# EAGLE design GeisaBoard (EAGLE 9.1.0)
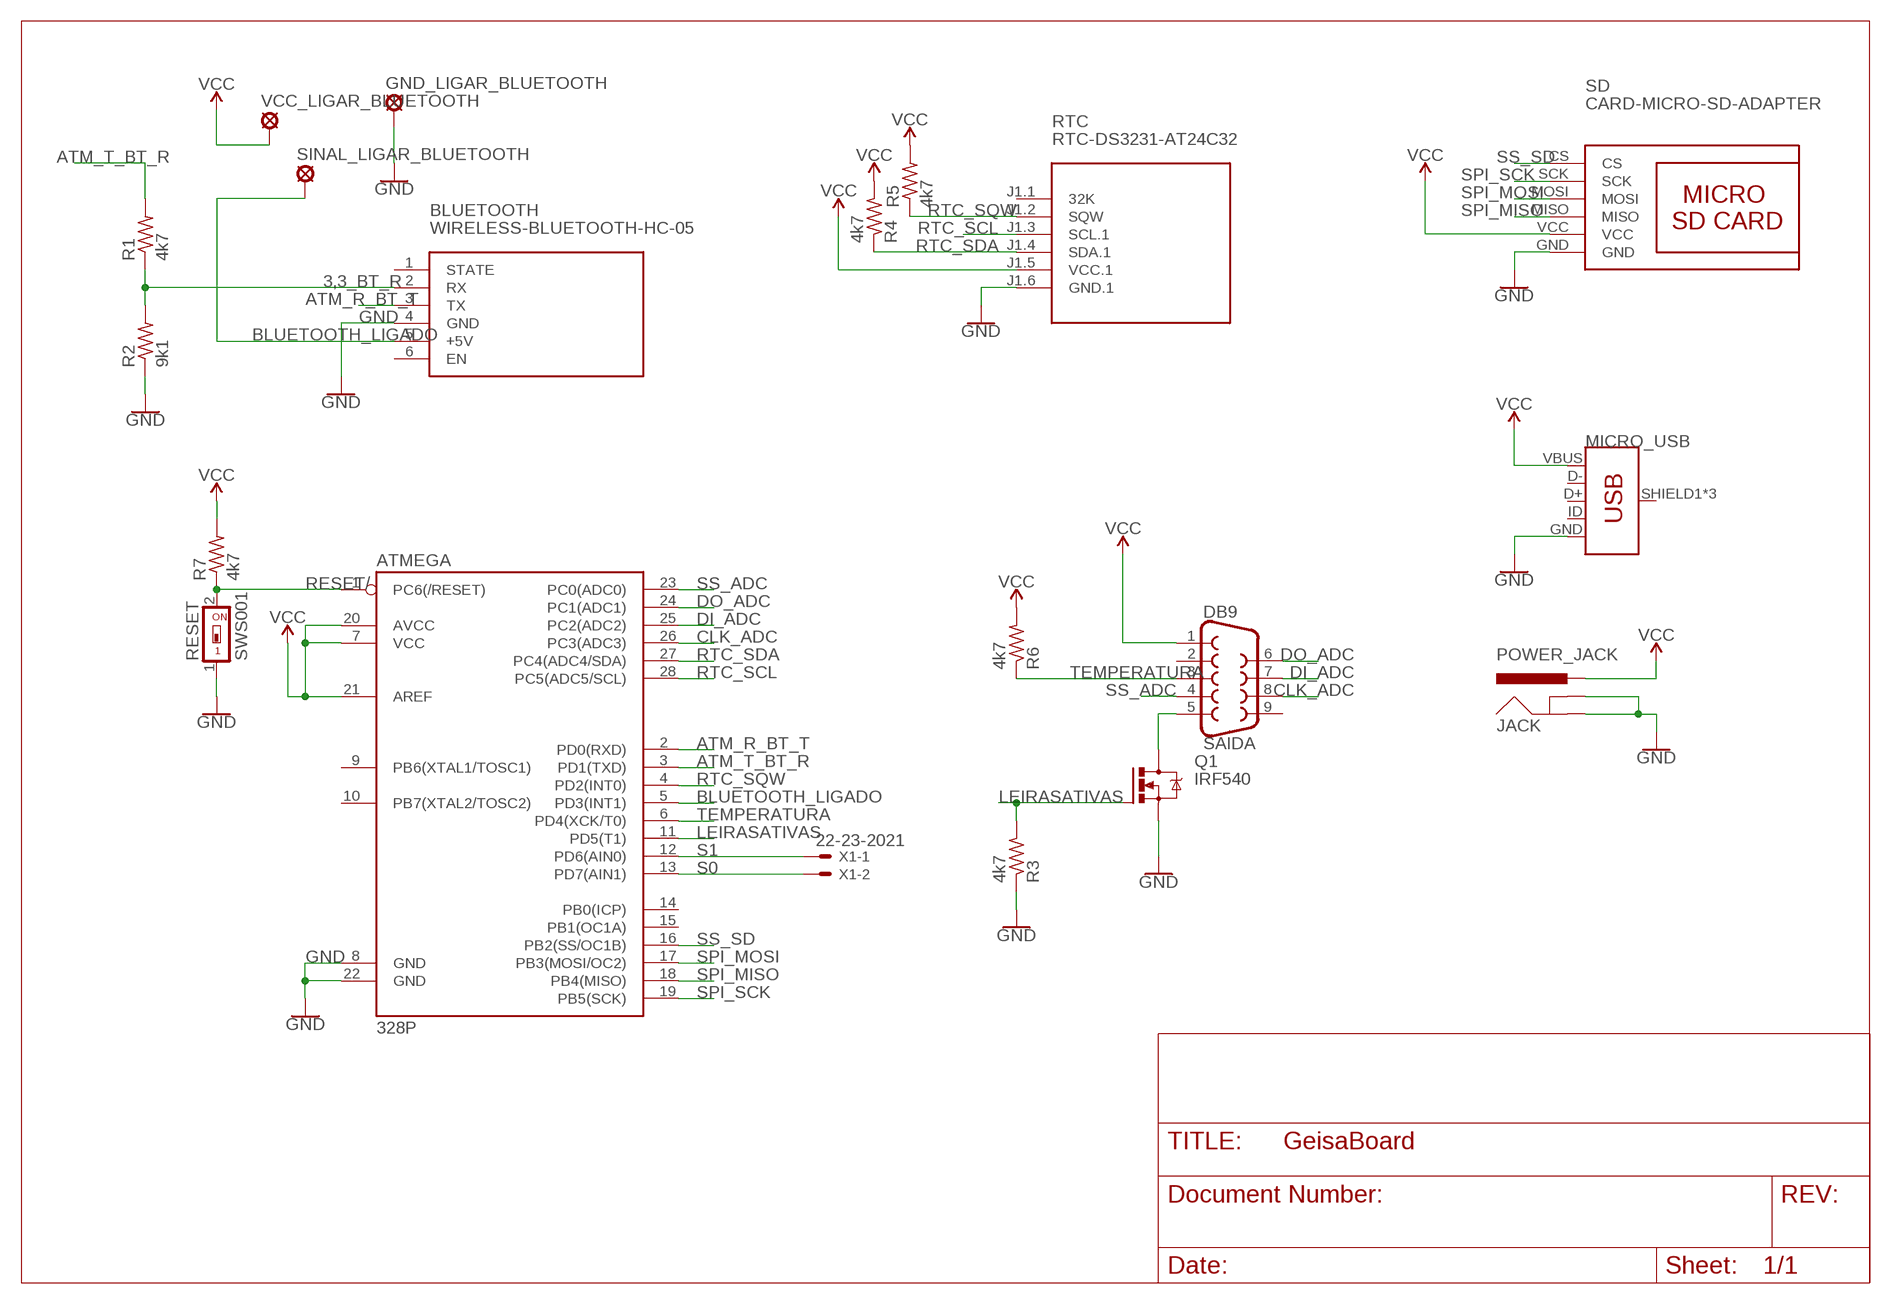
[diagram p0: schematic, sheet 1]

## Parts
ATMEGA  328P  ATMEGA328P_PDIP  [DIP28]
BLUETOOTH  WIRELESS-BLUETOOTH-HC-05  [WIRELESS-BLUETOOTH-HC-05]
DB9  SAIDA  DB9FEMALE  [DB9]
GND_LIGAR_BLUETOOTH  LSP11  [LSP11]
JACK  POWER_JACK  [POWER_JACK_PTH]
MICRO_USB  USB_MICRO-BREDUCED_PASTE  [USB-B-MICRO-SMD_RED_PASTE]
Q1  IRF540  [TO220BV]
R1  4k7  R-US_0204/7  [0204/7]
R2  9k1  R-US_0204/7  [0204/7]
R3  4k7  R-US_0204/7  [0204/7]
R4  4k7  R-US_0204/7  [0204/7]
R5  4k7  R-US_0204/7  [0204/7]
R6  4k7  R-US_0204/7  [0204/7]
R7  4k7  R-US_0204/7  [0204/7]
RESET  SWS001  [SMS-001]
RTC  RTC-DS3231-AT24C32  [RTC-DS3231-AT24C32]
SD  CARD-MICRO-SD-ADAPTER  [CARD-MICRO-SD-ADAPTER]
SINAL_LIGAR_BLUETOOTH  LSP11  [LSP11]
VCC_LIGAR_BLUETOOTH  LSP11  [LSP11]
X1  22-23-2021  [22-23-2021]

## Nets
3,3_BT_R: BLUETOOTH.2(RX) R1.1 R2.2
ATM_R_BT_T: ATMEGA.2(PD0(RXD)) BLUETOOTH.3(TX)
ATM_T_BT_R: ATMEGA.3(PD1(TXD)) R1.2
BLUETOOTH_LIGADO: ATMEGA.5(PD3(INT1)) BLUETOOTH.5(+5V) SINAL_LIGAR_BLUETOOTH.MP
CLK_ADC: ATMEGA.26(PC3(ADC3)) DB9.8
DI_ADC: ATMEGA.25(PC2(ADC2)) DB9.7
DO_ADC: ATMEGA.24(PC1(ADC1)) DB9.6
GND [alimentação]: ATMEGA.8(GND) ATMEGA.22(GND) BLUETOOTH.4(GND) GND_LIGAR_BLUETOOTH.MP JACK.GND JACK.GNDBREAK MICRO_USB.GND Q1.S R2.1 R3.1 RESET.1 RTC.J1.6(GND.1) SD.GND
LEIRASATIVAS: ATMEGA.11(PD5(T1)) Q1.G R3.2
N$2 [alimentação]: DB9.5 Q1.D
RESET/: ATMEGA.1(PC6(/RESET)) R7.1 RESET.2
RTC_SCL: ATMEGA.28(PC5(ADC5/SCL)) RTC.J1.3(SCL.1)
RTC_SDA: ATMEGA.27(PC4(ADC4/SDA)) R4.1 RTC.J1.4(SDA.1)
RTC_SQW: ATMEGA.4(PD2(INT0)) R5.1 RTC.J1.2(SQW)
S0: ATMEGA.13(PD7(AIN1)) X1.2
S1: ATMEGA.12(PD6(AIN0)) X1.1
SPI_MISO: ATMEGA.18(PB4(MISO)) SD.MISO
SPI_MOSI: ATMEGA.17(PB3(MOSI/OC2)) SD.MOSI
SPI_SCK: ATMEGA.19(PB5(SCK)) SD.SCK
SS_ADC: ATMEGA.23(PC0(ADC0)) DB9.4
SS_SD: ATMEGA.16(PB2(SS/OC1B)) SD.CS
TEMPERATURA: ATMEGA.6(PD4(XCK/T0)) DB9.3 R6.1
VCC [alimentação]: ATMEGA.7(VCC) ATMEGA.20(AVCC) ATMEGA.21(AREF) DB9.1 JACK.PWR MICRO_USB.VBUS R4.2 R5.2 R6.2 R7.2 RTC.J1.5(VCC.1) SD.VCC VCC_LIGAR_BLUETOOTH.MP
Unconnected: ATMEGA.9(PB6(XTAL1/TOSC1)) ATMEGA.10(PB7(XTAL2/TOSC2)) ATMEGA.14(PB0(ICP)) ATMEGA.15(PB1(OC1A)) BLUETOOTH.1(STATE) BLUETOOTH.6(EN) DB9.2 DB9.9 MICRO_USB.D+ MICRO_USB.D- MICRO_USB.ID MICRO_USB.SHIELD1(SHIELD) MICRO_USB.SHIELD2(SHIELD) MICRO_USB.SHIELD3(SHIELD) RTC.J1.1(32K)

## Library data of the parts
ATMEGA = SparkFun-IC-Microcontroller:ATMEGA328P_PDIP: Atmel 328P Through hole ATMEGA328P uC used in the Arduino 32kb flash, 1k EEPROM, 2k SRAM Datasheet <http://www.sparkfun.com/datasheets/Components/SMD/ATMega328.pdf> SparkFun Products Storefront component: AVR 28 Pin 20MHz 32K 6A/D - ATMega328P <https://www.sparkfun.com/products/9061> (COM-09061) SparkFun Simon Says - Through-Hole Soldering Kit <https://www.sparkfun.com/products/10547> (KIT-10547) SparkFun Learn to Solder - Simon Says <https://www.sparkfun.com/products/13708> (KIT-13708) SparkFun BigTime Watch Kit <https://www.sparkfun.com/products/11734> (KIT-11734) SparkFun ClockIt <https://www.sparkfun.com/products/10930> (KIT-10930) SparkFun Serial Enabled LCD Kit <https://www.sparkfun.com/products/10097> (LCD-10097) SparkFun Simon Tilts - Through Hole Soldering Kit <https://www.sparkfun.com/products/12634> (KIT-12634) SparkFun Frequency Counter Kit <https://www.sparkfun.com/products/10140> (KIT-10140) FabFM Radio Kit <https://www.sparkfun.com/products/11043> (KIT-11043) SparkFun Binary Blaster Kit <https://www.sparkfun.com/products/12037> (KIT-12037) SparkFun Metro-Gnome <https://www.sparkfun.com/products/9236> (KIT-09236) ATmega328 with Arduino Optiboot (Uno) <https://www.sparkfun.com/products/10524> (DEV-10524); PROD_ID: IC-09136
BLUETOOTH = diy-modules:WIRELESS-BLUETOOTH-HC-05: Bluetooth Transceiver Module based on HC-05 board Tutorial is available here: https://arduino-info.wikispaces.com/BlueTooth-HC05-HC06-Modules-How-To Click here to find device on ebay.com <http://www.ebay.com/sch/hc-05+module+rs232>
DB9 = SparkFun-Connectors:DB9: DB9 Connector Standard DB9 (D-Sub 9) serial connector. Can be used for CAN bus as well as RS485 and RS232. Footprint production proven. Here is the female version connector we sell at SparkFun: 9 Pin Female Serial Connector - PCB Mount <https://www.sparkfun.com/products/429> (PRT-00429) This connector has been used on the following SparkFun products: SparkFun RS232 Shifter - SMD <https://www.sparkfun.com/products/449> (PRT-00449) SparkFun RS232 Shifter SMD (No DB9) <https://www.sparkfun.com/products/8780> (PRT-08780); PROD_ID: CONN-08194
GND_LIGAR_BLUETOOTH SINAL_LIGAR_BLUETOOTH VCC_LIGAR_BLUETOOTH = solpad:LSP11: SOLDER PAD drill 1.1 mm
JACK = SparkFun-Connectors:POWER_JACK: Power Jack Connector This is the standard 5.5mm barrel jack for power. The PTH is the most common, proven, reliable, footprint. The Slot footprint only works if the mill layer is transmitted to the PCB fab house so be warned. Here are the connectors we sell at SparkFun: DC Barrel Power Jack/Connector <https://www.sparkfun.com/products/119> (PRT-00119) DC Barrel Power Jack/Connector (SMD) <https://www.sparkfun.com/products/12748> (PRT-12748) DC Barrel Jack Adapter - Breadboard Compatible <https://www.sparkfun.com/products/10811> (PRT-10811) It is used on this SparkFun product (and many, many others): SparkFun RedBoard - Programmed with Arduino <https://www.sparkfun.com/products/12757> (DEV-12757) Also, if you need a mating power supply or connector, please check these out: Wall Adapter Power Supply - 9VDC 650mA <https://www.sparkfun.com/products/298> (TOL-00298) DC Barrel Jack Adapter - Male <https://www.sparkfun.com/products/10287> (PRT-10287); PROD_ID: CONN-08197
MICRO_USB = SparkFun-Connectors:USB_MICRO-B: USB Type Micro-B Connector Male/female and PTH/SMT variants SparkFun Products: SparkFun microB USB Breakout <https://www.sparkfun.com/products/12035> SparkFun USB microB Plug Breakout <https://www.sparkfun.com/products/10031> SparkFun ESP8266 Thing <https://www.sparkfun.com/products/13231>; PROD_ID: CONN-11752
Q1 = transistor-power:IRF540: HEXFET Power MOSFET
R1-R7 = rcl:R-US_: RESISTOR, American symbol
RESET = smd-special:SWS001: SMD Dip Switch 1 pol.
RTC = Geisa:RTC-DS3231-AT24C32: RTC Module with Battery and EEPROM based on DS3231 and AT24C32 chips Tutorial can be found here: https://edwardmallon.wordpress.com/2014/05/21/using-a-cheap-3-ds3231-rtc-at24c32-eeprom-from-ebay/ Click here to find device on ebay.com <http://www.ebay.com/sch/DS3231+AT24C32+module>
SD = Geisa:CARD-MICRO-SD-ADAPTER
X1 = con-molex:22-23-2021: .100" (2.54mm) Center Header - 2 Pin; MF: MOLEX; MPN: 22-23-2021; OC_FARNELL: 1462926; OC_NEWARK: 25C3832

## Net classes
0 default: width 0.508 mm
1 alimentação: width 1.016 mm

## Board
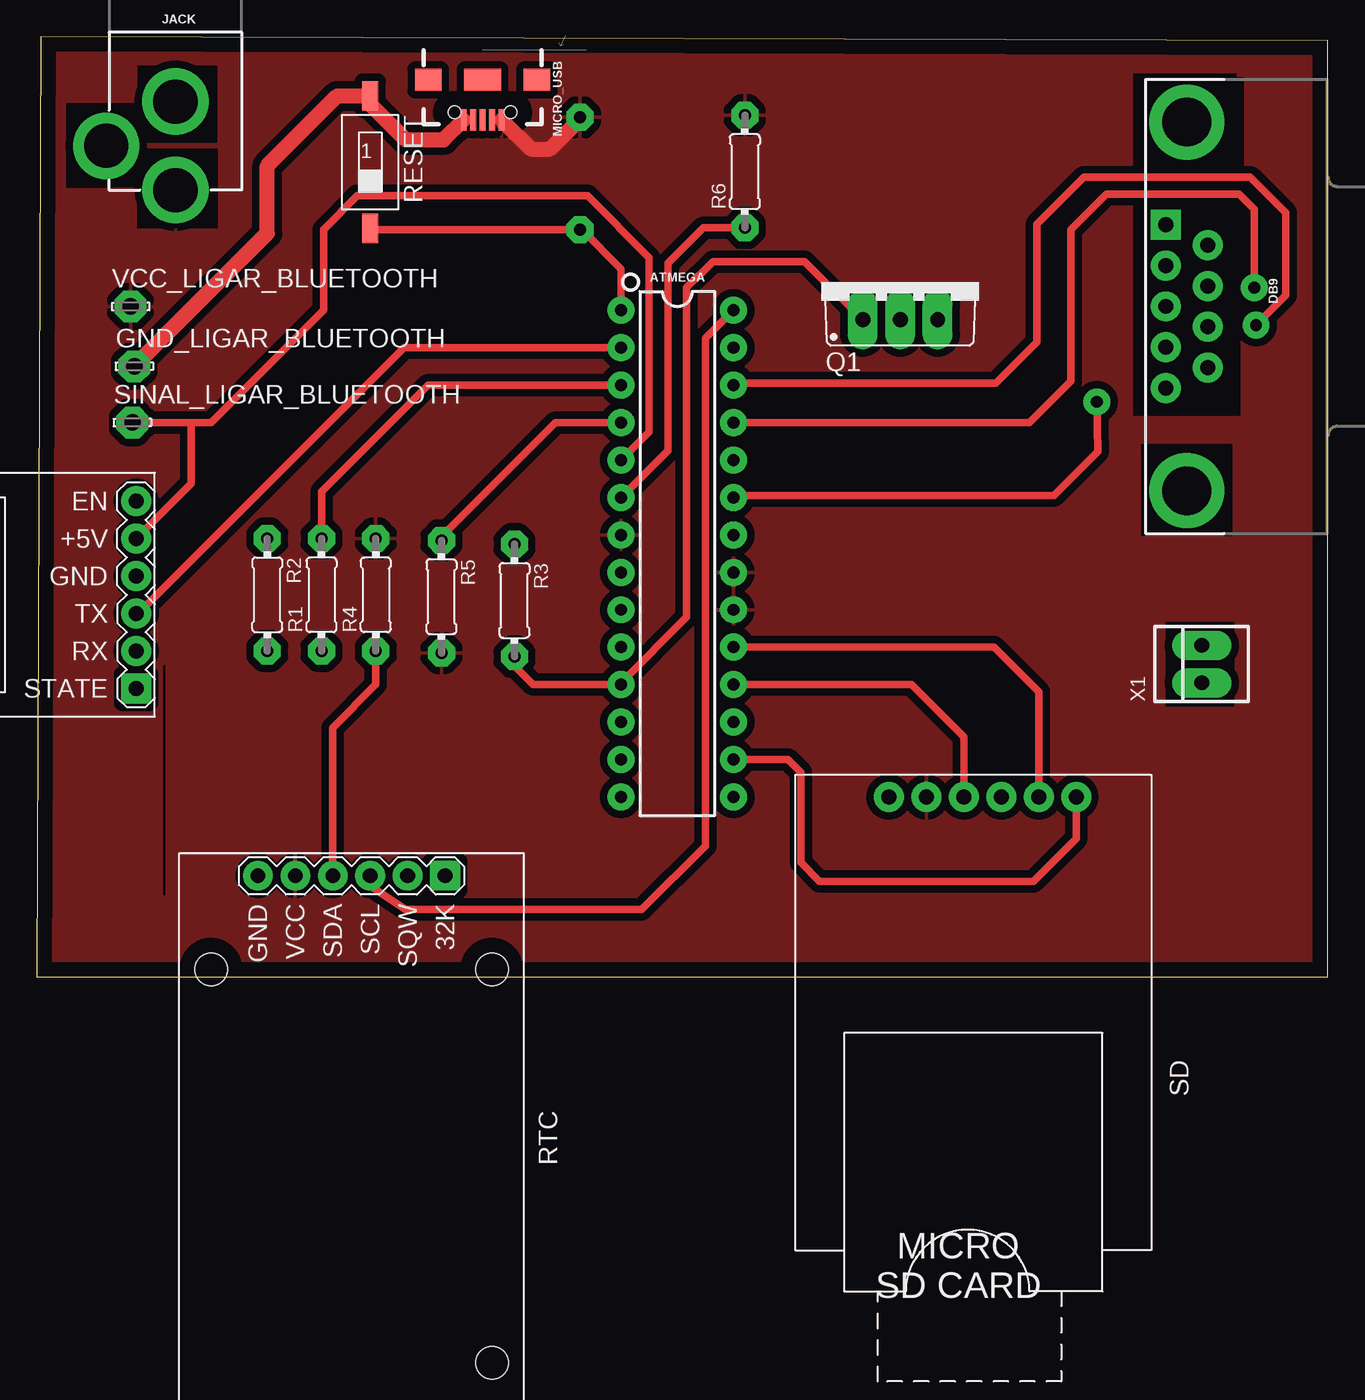
[diagram p1: board, top side]
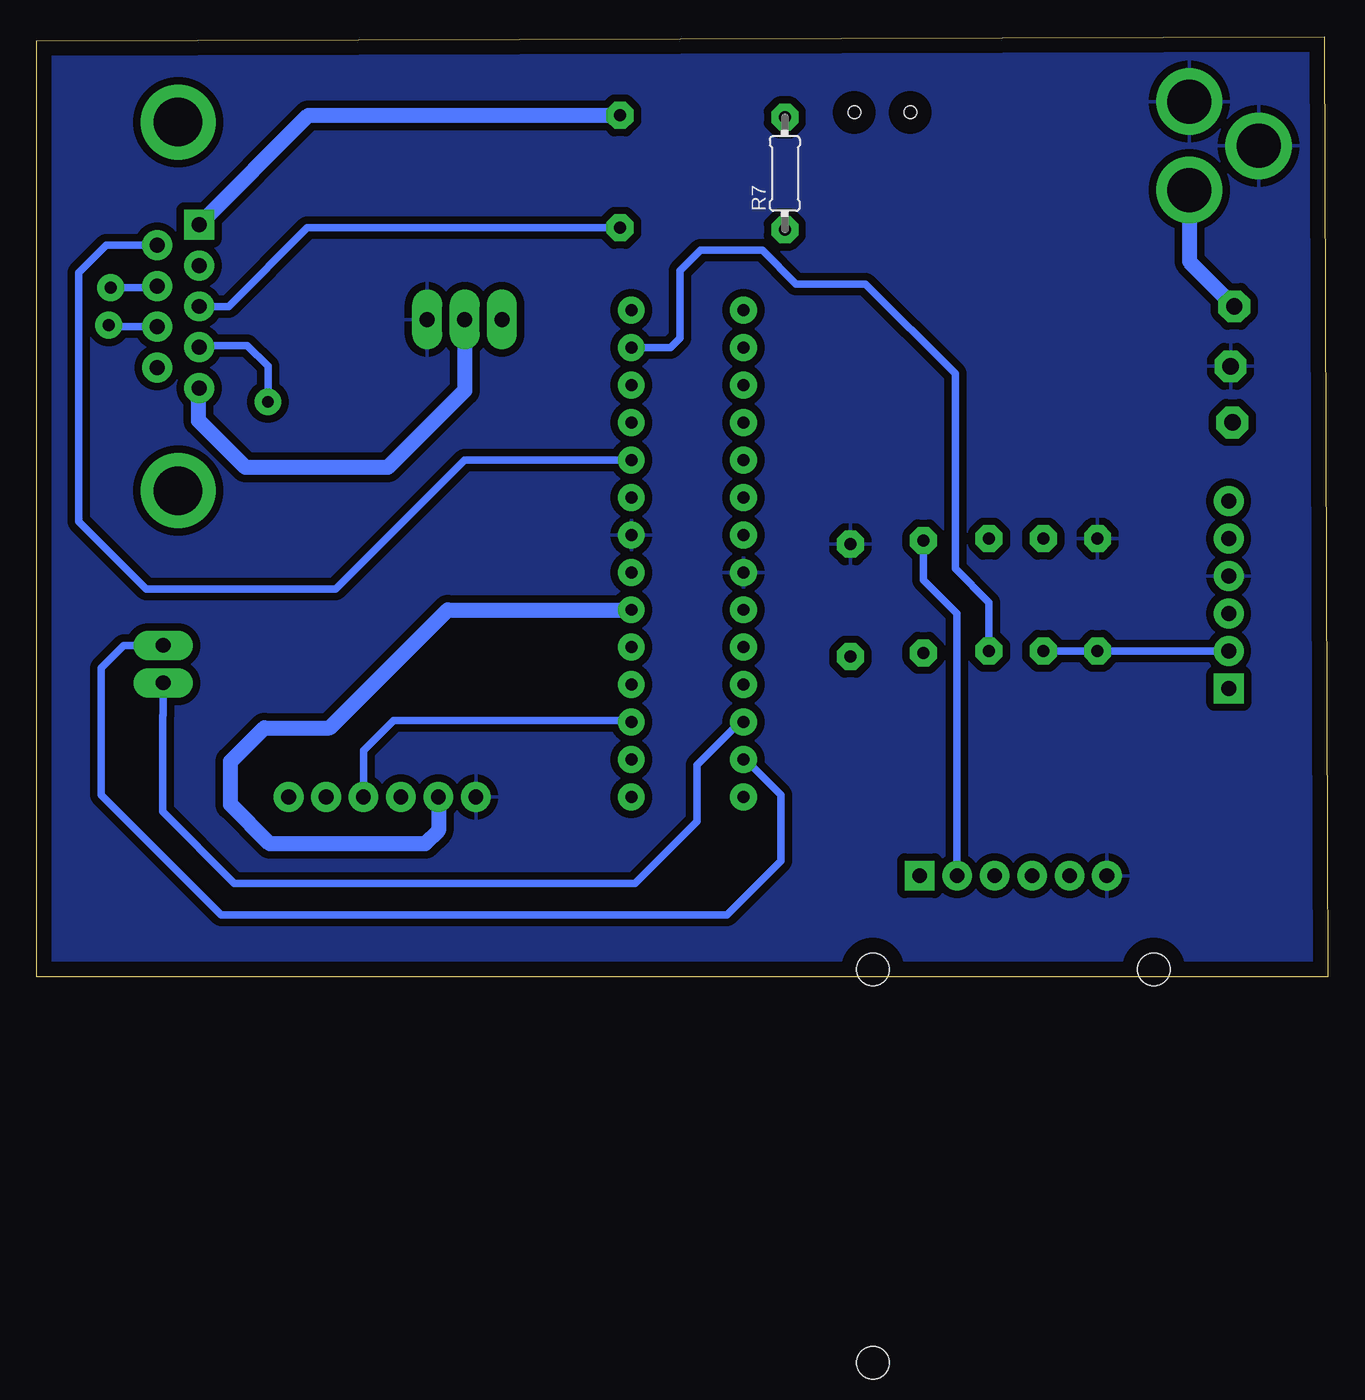
[diagram p2: board, bottom side, seen from below]

Size 87.55 x 63.74 mm. Coordinates in mm from the lower left corner, seen from the top.
Outline: 0,0 87.55,0 87.55,63.49 0.25,63.74 0,0
Copper layers (1*16): Top 0.035mm / dielectric 1.5mm / Bottom 0.035mm
Design rules "default *": minimum track width 20mil, minimum drill 0.8mm, track to track 20mil, track to pad 20mil, pad to pad 20mil, via to via 20mil, smd to smd 20mil, copper to edge 40mil, drill to drill 31.5mil, minimum pad ring 20mil, minimum via ring 20mil, stop-mask expansion 4mil, vias tented up to drill 0mil, thermal gap 20mil
tRestrict: area 8.6,27.9 to 11.2,27.9; area 74.4,38.1 to 81.5,52.6; area 74.2,54.9 to 81.8,61.2; area 74.9,30 to 81,36.1; area 76.6,18.4 to 81.2,24; area 68.6,-4.1 to 84.3,-1; area 8.6,5.6 to 8.6,21.1; area 2,53.6 to 7.1,59.2; area 6.9,50.8 to 12.2,56.1; area 6.9,56.6 to 12.2,61.7

### Footprints (pad centres in the part's own frame; a part is rotated, then mirrored left to right if it is on the bottom)
DIP28 = drill 0.813 pad 1.626: 1 -16.51,-3.81; 2 -13.97,-3.81; 3 -11.43,-3.81; 4 -8.89,-3.81; 5 -6.35,-3.81; 6 -3.81,-3.81; 7 -1.27,-3.81; 8 1.27,-3.81; 9 3.81,-3.81; 10 6.35,-3.81; 11 8.89,-3.81; 12 11.43,-3.81; 13 13.97,-3.81; 14 16.51,-3.81; 15 16.51,3.81; 16 13.97,3.81; 17 11.43,3.81; 18 8.89,3.81; 19 6.35,3.81; 20 3.81,3.81; 21 1.27,3.81; 22 -1.27,3.81; 23 -3.81,3.81; 24 -6.35,3.81; 25 -8.89,3.81; 26 -11.43,3.81; 27 -13.97,3.81; 28 -16.51,3.81
WIRELESS-BLUETOOTH-HC-05 = drill 1 square: 1 -6.35,-17.145 | drill 1: 2 -3.81,-17.145; 3 -1.27,-17.145; 4 1.27,-17.145; 5 3.81,-17.145; 6 6.35,-17.145
DB9 = drill 1.016 pad 1.88 square: 1 -5.54,-1.42 | drill 1.016 pad 1.88: 2 -2.77,-1.42; 3 0,-1.42; 4 2.77,-1.42; 5 5.54,-1.42; 6 -4.15,1.42; 7 -1.38,1.42; 8 1.38,1.42; 9 4.15,1.42 | drill 3.302 pad 5.08: G1 -12.5,0; G2 12.5,0
LSP11 = drill 1.118 pad 2.159 octagon: MP 0,0
POWER_JACK_PTH = drill 2.997 pad 4.318: GND 0,7.7; GNDBREAK 4.7,10.7; PWR 0,13.7
USB-B-MICRO-SMD_RED_PASTE = smd 1.45 x 0.4: D+ 2.725,0; D- 2.725,0.65; GND 2.725,-1.3; ID 2.725,-0.65; VBUS 2.725,1.3 | smd 1.5 x 1.8: SHIELD1 0,3.685; SHIELD2 0,-3.685 | smd 1.5 x 2.5: SHIELD3 0,0 | hole 0.85: 2.2,1.9; 2.2,-1.9
TO220BV = drill 1.016 long: D 0,-2.54; G -2.54,-2.54; S 2.54,-2.54
0204/7 = drill 0.813 octagon: 1 -3.81,0; 2 3.81,0
SMS-001 = smd 1.092 x 2.007: 1 0,-4.496; 2 0,4.496
RTC-DS3231-AT24C32 = drill 1 square: J1.1 -17.78,6.35 | drill 1: J1.2 -17.78,3.81; J1.3 -17.78,1.27; J1.4 -17.78,-1.27; J1.5 -17.78,-3.81; J1.6 -17.78,-6.35 | hole 2.2: -11.43,-9.525; -11.43,9.525; 15.24,9.525
CARD-MICRO-SD-ADAPTER = drill 1: CS -11.43,5.08; GND -11.43,-7.62; MISO -11.43,-2.54; MOSI -11.43,0; SCK -11.43,2.54; VCC -11.43,-5.08
22-23-2021 = drill 1 long: 1 -1.27,0; 2 1.27,0

### Placement (x,y rotation side)
ATMEGA  43.43,28.7 270 top
BLUETOOTH  -10.41,25.91 90 top
DB9  77.98,45.47 270 top
GND_LIGAR_BLUETOOTH  6.6,41.4 0 top
JACK  9.4,67.06 180 top
MICRO_USB  30.23,60.83 270 top
Q1  58.55,47.12 0 top
R1  19.3,25.91 90 top
R2  15.62,25.91 270 top
R3  32.38,25.53 270 top
R4  22.99,25.91 90 top
R5  27.43,25.78 270 top
R6  48.01,54.61 90 top
R7  36.83,54.48 90 bottom
RESET  22.61,55.25 180 top
RTC  21.34,-10.92 270 top
SD  65.41,0.76 270 top
SINAL_LIGAR_BLUETOOTH  6.48,37.59 0 top
VCC_LIGAR_BLUETOOTH  6.35,45.47 0 top
X1  78.99,21.21 90 top

### Tracks (layer width: path | path; a pad name or v marks a point on that pad's centre or on a via)
3,3_BT_R
  Bottom 0.508: R1.1 R2.2 BLUETOOTH.2
ATM_R_BT_T
  Top 0.508: ATMEGA.2 24.89,42.67 7.24,25.02 BLUETOOTH.3
ATM_T_BT_R
  Top 0.508: ATMEGA.3 26.54,40.13 19.3,32.89 R1.2
BLUETOOTH_LIGADO
  Top 0.508: ATMEGA.5 41.53,36.96 41.53,48.77 37.34,52.96 21.72,52.96 19.43,50.67 19.43,45.21 11.81,37.59 10.54,37.59 | BLUETOOTH.5 10.48,33.46 10.48,37.53 10.54,37.59 | 10.54,37.59 7.75,37.59 SINAL_LIGAR_BLUETOOTH.MP
CLK_ADC  (via drill 0.8)
  Top 0.508: v82.68,44.2 84.71,46.23 84.71,51.82 82.3,54.23 70.99,54.23 67.82,51.05 67.82,43.05 65.02,40.26 47.24,40.26 ATMEGA.26
  Bottom 0.508: DB9.8 82.57,44.09 v82.68,44.2
DI_ADC  (via drill 0.8)
  Top 0.508: ATMEGA.25 67.31,37.59 70.1,40.39 70.1,50.67 72.52,53.09 81.53,53.09 82.55,52.07 v82.55,46.74
  Bottom 0.508: v82.55,46.74 79.51,46.74 DB9.7
DO_ADC
  Bottom 0.508: ATMEGA.24 58.55,35.05 67.31,26.29 80.14,26.29 84.71,30.86 84.71,47.75 82.84,49.62 DB9.6
GND
  Top 1.016: 6.6,41.53 GND_LIGAR_BLUETOOTH.MP 15.62,50.42 15.62,54.99 20.37,59.74 RESET.1 22.61,59.18 25.02,56.77 27.59,56.77 MICRO_USB.GND
  pour Bottom: 101.09,-16.76 0.25,-16.76 0.25,66.55 101.09,66.55
LEIRASATIVAS
  Top 0.508: 39.62,19.94 44.07,24.38 44.07,46.74 45.85,48.51 52.07,48.51 Q1.G | 39.62,19.94 ATMEGA.11 | R3.2 32.38,21.08 33.66,19.81 39.5,19.81 39.62,19.94
N$2
  Bottom 1.016: Q1.D 58.55,39.75 63.75,34.54 73.41,34.54 76.58,37.72 76.58,39.9 DB9.5
RESET/
  Top 0.508: RESET.2 22.68,50.67 R7.1 36.96,50.67 39.62,48.01 ATMEGA.1
RTC_SCL
  Top 0.508: RTC.J1.3 22.61,6.18 25.02,4.57 41.02,4.57 45.34,8.89 45.34,11.05 45.34,43.31 ATMEGA.28
RTC_SDA
  Top 0.508: RTC.J1.4 20.07,16.89 22.99,19.81 R4.1
  Bottom 0.508: ATMEGA.27 44.58,42.67 43.94,43.31 43.94,47.88 42.54,49.28 38.35,49.28 36.07,46.99 31.37,46.99 25.27,40.89 25.27,27.69 22.99,25.4 R4.1
RTC_SQW
  Top 0.508: ATMEGA.4 35.18,37.59 27.43,29.84 R5.1
  Bottom 0.508: R5.1 27.43,26.92 25.15,24.64 RTC.J1.2
S0
  Bottom 0.508: ATMEGA.13 39.5,14.73 37.08,12.32 37.08,7.87 40.77,4.19 75.06,4.19 83.19,12.32 83.19,20.95 81.66,22.48 X1.2
S1
  Bottom 0.508: ATMEGA.12 39.88,17.27 42.8,14.35 42.8,10.54 46.99,6.35 74.17,6.35 79.03,11.21 79.03,17.72 78.99,17.75 X1.1
SPI_MISO
  Top 0.508: SD.MISO 62.86,16.26 59.31,19.81 ATMEGA.18
SPI_MOSI
  Bottom 0.508: ATMEGA.17 47.24,17.4 63.37,17.4 65.41,15.37 SD.MOSI
SPI_SCK
  Top 0.508: SD.SCK 67.95,19.3 64.9,22.35 ATMEGA.19
SS_ADC  (via drill 0.8)
  Top 0.508: v71.88,38.99 71.95,35.63 68.96,32.64 47.24,32.64 ATMEGA.23
  Bottom 0.508: DB9.4 76.45,42.8 73.28,42.8 71.88,41.4 v71.88,38.99
SS_SD
  Top 0.508: 51.82,13.59 51.82,7.75 53.09,6.48 67.56,6.48 70.48,9.4 SD.CS | 51.82,13.59 51.82,13.84 | ATMEGA.16 50.93,14.73 51.82,13.84 | 51.82,13.84 51.82,13.59
TEMPERATURA
  Top 0.508: ATMEGA.6 39.75,32.64 42.8,35.69 42.8,48.39 45.21,50.8 R6.1
  Bottom 0.508: DB9.3 74.55,45.47 69.22,50.8 R6.1
VCC
  Top 1.016: MICRO_USB.VBUS 33.5,56.13 34.8,56.13 36.83,58.17 R7.2
  Bottom 1.016: JACK.PWR 9.4,48.51 VCC_LIGAR_BLUETOOTH.MP | ATMEGA.20 59.69,24.89 67.69,16.89 72.14,16.89 74.42,14.61 74.42,11.68 71.76,9.02 61.21,9.02 60.32,9.91 SD.VCC | DB9.1 69.14,58.42 R6.2
  pour Top: -1.27,64.52 -1.27,-17.78 101.85,-17.78 101.85,65.02 -1.27,65.02